# Altium schematic sheet Additional Circuits - Handheld - Rev 3b.SchDoc: Secure Handheld J1939 Logger
size Letter; Organization: Dr. Jeremy Daily; Address1: Systems Engineering; Address2: Engineering A202; Address3: Fort Collins, CO 80523; Address4: www.engr.colostate.edu/se/; DocumentNumber: Wifi, J1708, USB, and Security; Revision: 3c; SheetNumber: 2; SheetTotal: 3
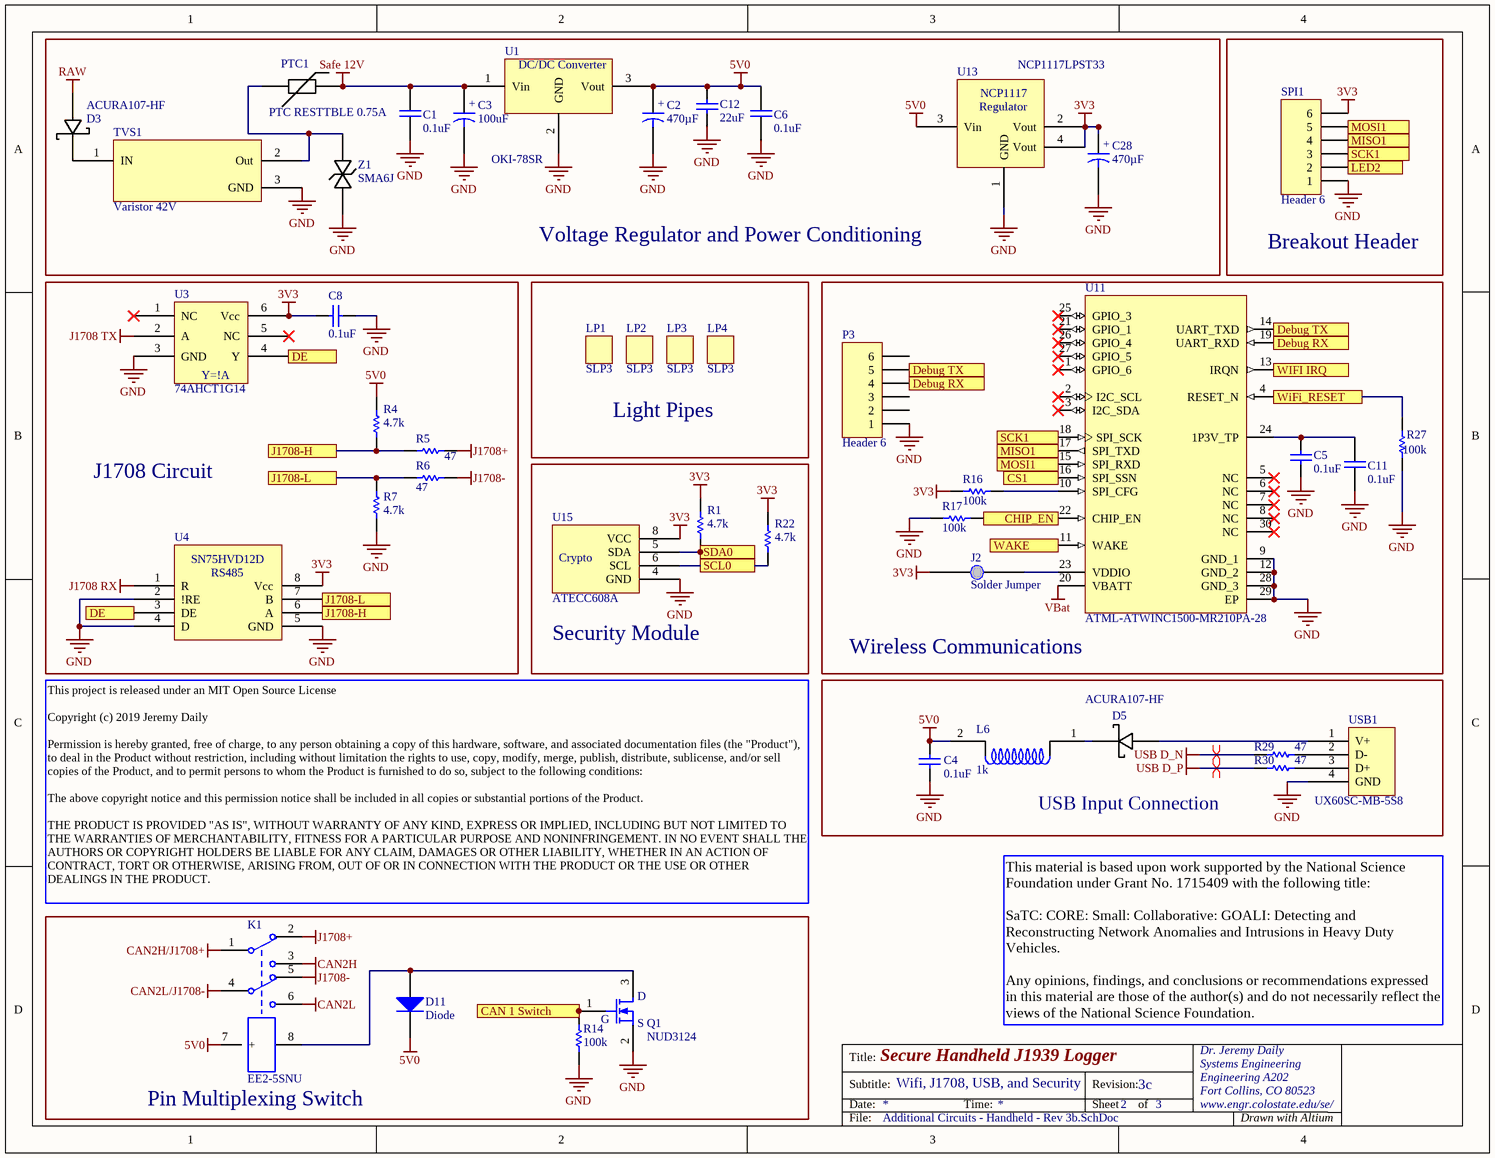
[diagram p0: Additional Circuits - Handheld - Rev 3b.SchDoc]

## Parts
C1  0.1uF  [0603]
C2  470µF  [Elec. Cap - G]
C3  100uF  [Elec. Cap - G]
C4  0.1uF  [0603]
C5  0.1uF  [0603]
C6  0.1uF  [0603]
C8  0.1uF  [0603]
C11  0.1uF  [0603]
C12  22uF  [1206]
C28  470µF  [Elec. Cap - G]
D3  ACURA107-HF  [SMA with A and K]
D5  ACURA107-HF  [SMA with A and K]
D11  Diode  [CST2C]
J2  Solder Jumper  [Solder Jumper]
K1  EE2-5SNU  [RELAY - EE2]
L6  1k  [0603]
LP1  SLP3  [PCBComponent_1]
LP2  SLP3  [PCBComponent_1]
LP3  SLP3  [PCBComponent_1]
LP4  SLP3  [PCBComponent_1]
P3  Header 6  [HDR1X6]
PTC1  PTC RESTTBLE 0.75A  [1812]
Q1  NUD3124  [SOT23_N]
R1  4.7k  [0603]
R4  4.7k  [0603]
R5  47  [0603]
R6  47  [0603]
R7  4.7k  [0603]
R14  100k  [0603]
R16  100k  [0603]
R17  100k  [0603]
R22  4.7k  [0603]
R27  100k  [0603]
R29  47  [0603]
R30  47  [0603]
SPI1  Header 6  [HDR1X6]
TVS1  Varistor 42V  [Transfeed]
U1  OKI-78SR  [OKI-78SR]
U3  74AHCT1G14  [SOT-353]
U4  SN75HVD08DR  [SOIC-SN8_N]  (value not drawn)
U11  ATML-ATWINC1500-MR210PA-28  [ATML-ATWINC1500-MR210PA-28_V]
U13  NCP1117LPST33  [SOT-223]
U15  ATECC608A  [SOIC-8]
USB1  UX60SC-MB-5S8  [USB Mini UX60S]
Z1  SMA6J  [SMA]

## Blocks framed on the sheet
Voltage Regulator and Power Conditioning: C1-C3 C6 C12 C28 D3 PTC1 TVS1 U1 U13 Z1
Breakout Header: SPI1
J1708 Circuit: C8 R4-R7 U3 U4
Light Pipes: LP1-LP4
Wireless Communications: C5 C11 J2 P3 R16 R17 R27 U11
Security Module: R1 R22 U15
USB Input Connection: C4 D5 L6 R29 R30 USB1
Pin Multiplexing Switch: D11 K1 Q1 R14

## Ports
CAN 1 Switch, CHIP_EN, CS1, DE, Debug RX, Debug TX, J1708-H, J1708-L, LED2, MISO1, MOSI1, SCK1, SCL0, SDA0, WAKE, WIFI IRQ, WiFi_RESET

## Nets
3V3: C8.2 C28.1 J2.1 R1.1 R16.2 R22.1 SPI1.6 U3.6(Vcc) U4.8(Vcc) U13.2(Vout) U13.4(Vout) U15.8(VCC)
5V0: C2.1 C4.1 C6.2 C12.2 D11.2(K) K1.7(+) L6.2 R4.1 U1.3(Vout) U13.3(Vin)
CAN2H: K1.3
CAN2H/J1708+: K1.1(COM1)
CAN2L: K1.6
CAN2L/J1708-: K1.4
GND: C1.1 C2.2(-) C3.2(-) C4.2 C5.1 C6.1 C8.1 C11.1 C12.1 C28.2(-) P3.1 Q1.2(Source) R7.2 R14.1 R17.2 R27.2 SPI1.1 TVS1.3(GND) U1.2(GND) U3.3(GND) U4.2(!RE) U4.4(D) U4.5(GND) U11.9(GND_1) U11.12(GND_2) U11.28(GND_3) U11.29(EP) U13.1(GND) U15.4(GND) USB1.4(GND) Z1.1(A)
J1708 RX: U4.1(R)
J1708 TX: U3.2(A)
J1708+: K1.2 R5.2
J1708-: K1.5 R6.2
RAW: D3.1(A)
Safe 12V: C1.2 C3.1 PTC1.2 U1.1(Vin)
USB D_N: R29.1
USB D_P: R30.1
VBat: U11.20(VBATT)
CAN 1 Switch: Q1.1(Gate) R14.2 ; port CAN 1 Switch
CHIP_EN: R17.1 U11.22(CHIP_EN) ; port CHIP_EN
CS1: U11.16(SPI_SSN) ; port CS1
DE: U3.4(Y) U4.3(DE) ; port DE
Debug RX: P3.4 U11.19(UART_RXD) ; port Debug RX
Debug TX: P3.5 U11.14(UART_TXD) ; port Debug TX
J1708-H: R4.2 R5.1 U4.6(A) ; port J1708-H
J1708-L: R6.1 R7.1 U4.7(B) ; port J1708-L
LED2: SPI1.2 ; port LED2
MISO1: SPI1.4 U11.17(SPI_TXD) ; port MISO1
MOSI1: SPI1.5 U11.15(SPI_RXD) ; port MOSI1
SCK1: SPI1.3 U11.18(SPI_SCK) ; port SCK1
SCL0: R22.2 U15.6(SCL) ; port SCL0
SDA0: R1.2 U15.5(SDA) ; port SDA0
WAKE: U11.11(WAKE) ; port WAKE
WIFI IRQ: U11.13(IRQN) ; port WIFI IRQ
WiFi_RESET: R27.1 U11.4(RESET_N) ; port WiFi_RESET
NetC5_2: C5.2 C11.2 U11.24(1P3V_TP)
NetD3_2: D3.2(K) TVS1.1(IN)
NetD5_1: D5.1(A) USB1.1(V+)
NetD5_2: D5.2(K) L6.1
NetD11_1: D11.1(A) K1.8(-) Q1.3(Drain)
NetJ2_2: J2.2 U11.23(VDDIO)
NetPTC1_1: PTC1.1 TVS1.2(Out) Z1.2(K)
NetR16_1: R16.1 U11.10(SPI_CFG)
NetR29_2: R29.2 USB1.2(D-)
NetR30_2: R30.2 USB1.3(D+)

Not connected (* = marked no-connect by the designer): P3 2 3 6; U3 1(NC)* 5(NC)*; U11 1(GPIO_6)* 2(I2C_SCL)* 3(I2C_SDA)* 5(NC)* 6(NC)* 7(NC)* 8(NC)* 21(GPIO_1)* 25(GPIO_3)* 26(GPIO_4)* 27(GPIO_5)* 30(NC)*

## Layout directives
differential pair: USB D_N, USB D_P

## Notes on the sheet
- This project is released under an MIT Open Source License
  Copyright (c) 2019 Jeremy Daily
  Permission is hereby granted, free of charge, to any person obtaining a copy of this hardware, software, and associated documentation files (the "Product"), to deal in the Product without restriction, including without limitation the rights to use, copy, modify, merge, publish, distribute, sublicense, and/or sell copies of the Product, and to permit persons to whom the Product is furnished to do so, subject to the following conditions:
  The above copyright notice and this permission notice shall be included in all copies or substantial portions of the Product.
  THE PRODUCT IS PROVIDED "AS IS", WITHOUT WARRANTY OF ANY KIND, EXPRESS OR IMPLIED, INCLUDING BUT NOT LIMITED TO THE WARRANTIES OF MERCHANTABILITY, FITNESS FOR A PARTICULAR PURPOSE AND NONINFRINGEMENT. IN NO EVENT SHALL THE AUTHORS OR COPYRIGHT HOLDERS BE LIABLE FOR ANY CLAIM, DAMAGES OR OTHER LIABILITY, WHETHER IN AN ACTION OF CONTRACT, TORT OR OTHERWISE, ARISING FROM, OUT OF OR IN CONNECTION WITH THE PRODUCT OR THE USE OR OTHER DEALINGS IN THE PRODUCT.
- This material is based upon work supported by the National Science Foundation under Grant No. 1715409 with the following title:
  SaTC: CORE: Small: Collaborative: GOALI: Detecting and Reconstructing Network Anomalies and Intrusions in Heavy Duty Vehicles.
  Any opinions, findings, and conclusions or recommendations expressed in this material are those of the author(s) and do not necessarily reflect the views of the National Science Foundation.
- Title:
- Subtitle:
- Date:
- Time:
- Revision:
- Sheet
- of
- File:
- Drawn with Altium
- (in symbol 74AHCT1G14 Inverter) Y=!A
- (in symbol 7805) DC/DC Converter
- (in symbol ATECC508A) Crypto
- (in symbol IRLML6344TRPbF) D; G; S
- (in symbol NCP1117 2.5V) NCP1117; Regulator
- (in symbol SN75HVD12D (3.3v RS485)) SN75HVD12D; RS485
- (in symbol Tantalum Cap_1) +

## Library data of the parts
C1 C4-C6 C8 C11 = Cap: CAP CER 0.1UF 50V X7R 0603; Manufacturer: KEMET; PartNumber: C0603C104K5RACAUTO; Alternative: Acceptable; Supplier 1: Digi-Key; Supplier Part Number 1: 399-6856-1-ND
C2 C28 = Tantalum Cap_1: 470µF 16V Aluminum Electrolytic Capacitors Radial, Can - SMD  5000 Hrs @ 105°C; Manufacturer: Panasonic Electronic Components; PartNumber: EEE-HC1C471P; Supplier 1: Digi-Key; Supplier Part Number 1: PCE3751CT-ND
C3 = Tantalum Cap_1: Aluminum Electrolytic Capacitors Radial, Can - SMD 5000 Hrs @ 105°C; Manufacturer: Panasonic Electronic Components; PartNumber: EEE-HC1H101P; Supplier 1: Digi-Key; Supplier Part Number 1: P19732CT-ND
C12 = Cap: 22µF ±20% 25V Ceramic Capacitor X5R 1206 (3216 Metric); Manufacturer: Murata Electronics North America; PartNumber: GRT31CR61E226ME01L; Supplier 1: Digi-Key; Supplier Part Number 1: 490-12451-1-ND
D3 D5 = Schottky Diode: Diode Schottky 1000V 1A Surface Mount DO-214AC (SMA); Manufacturer: Comchip Technology; Supplier 1: Digi-Key; Supplier Part Number 1: 641-1884-1-ND; PartNumber: ACURA107-HF
D11 = Diode: Default Diode; Manufacturer: Toshiba Semiconductor and Storage; PartNumber: CCS15S30L3FCT-ND; Supplier 1: Digi-Key; Supplier Part Number 1: CCS15S30L3FCT-ND
K1 = DPDT Relay: General Purpose Relay DPDT (2 Form C) Surface Mount; Manufacturer: KEMET; Supplier 1: Digi-Key; Supplier Part Number 1: 399-11057-5-ND; PartNumber: EE2-5SNU
L6 = Ferrite Bead: Ferrite Beads Multi-Layer Power 1KOhm 25% 100MHz 1A 200mOhm DCR 0603 Automotive T/R; Manufacturer: Murata; PartNumber: BLM18KG102SZ1D; Alternative: Acceptable; Supplier 1: Digi-Key; Supplier Part Number 1: 490-17350-1-ND
LP1-LP4 = SLP3: Light Pipe Single Clear Rigid Round with Domed Top, 3mm Board Mount, Press Fit, Right Angle; Manufacturer: Bivar Inc.; PartNumber: SLP3-150-250-R; Supplier 1: Digi-Key; Supplier Part Number 1: 492-2517-ND
P3 SPI1 = Header 6: Header, 6-Pin
PTC1 = PTC: PTC RESTTBLE 0.75A 33V CHIP 1812; Manufacturer: Bel Fuse Inc.; PartNumber: 0ZCG0075BF2B; Supplier 1: Digi-Key; Supplier Part Number 1: 507-1765-1-ND
Q1 = IRLML6344TRPbF: IC INDCT LOAD DRVR AUTO SOT23; Manufacturer: ON Semiconductor; PartNumber: NUD3124LT1G; Alternative: None; Supplier 1: Digi-Key; Supplier Part Number 1: NUD3124LT1GOSCT-ND
R1 R4 R7 R22 = Chip Resistor: 4.7 kOhms ±1% 0.1W, 1/10W Chip Resistor 0603 (1608 Metric) Automotive AEC-Q200, High Voltage Thick Film; Manufacturer: Rohm Semiconductor; PartNumber: KTR03EZPF4701; Alternative: Acceptable; Supplier 1: Digi-Key; Supplier Part Number 1: RHM4.7KAYCT-ND
R5 R6 R29 R30 = Chip Resistor: ±1% 0.1W, 1/10W Chip Resistor 0603 (1608 Metric) Automotive AEC-Q200, High Voltage Thick Film; Manufacturer: Rohm Semiconductor; PartNumber: KTR03EZPF47R0; Supplier 1: Digi-Key; Supplier Part Number 1: RHM47AYCT-ND
R14 R16 R17 R27 = Chip Resistor: 100 kOhms ±1% 0.1W, 1/10W Chip Resistor 0603 (1608 Metric) Automotive AEC-Q200, High Voltage Thick Film; Manufacturer: Rohm Semiconductor; PartNumber: KTR03EZPF1003; Alternative: Acceptable; Supplier 1: Digi-Key; Supplier Part Number 1: RHM100KAYCT-ND
TVS1 = Transfeed: VARISTOR CAP FEEDTHRU 18V 0805; Manufacturer: AVX; PartNumber: V2F118A400Y2EDP; Supplier 1: Digi-Key; Supplier Part Number 1: 478-2485-1-ND
U1 = 7805: 5V DC/DC Converter (7805 replacement); Manufacturer: Murata Power Solutions Inc.; PartNumber: OKI-78SR-5/1.5-W36H-C; Supplier 1: Digi-Key; Supplier Part Number 1: 811-2692-ND
U3 = 74AHCT1G14 Inverter: IC SCHMIT-TRIGG INV GATE SOT353; Manufacturer: Diodes Incorporated; PartNumber: 74AHCT1G14SE-7; Supplier 1: Digi-Key; Supplier Part Number 1: 74AHCT1G14SE-7DICT-ND
U4 = SN75HVD12D (3.3v RS485): IC RS485 TXRX 3/5V 8-SOIC; Manufacturer: Texas Instruments; PartNumber: SN75HVD08DR; Supplier 1: Digi-Key; Supplier Part Number 1: 296-37893-1-ND
U11 = ATML-ATWINC1500-MR210PA-28: SMARTCONNECT ATWINC1500B-MU-T MO; Manufacturer: Microchip Technologies; PartNumber: ATWINC1510-MR210PB1140; Supplier 1: Digi-Key; Supplier Part Number 1: ATWINC1510-MR210PB1140-ND
U13 = NCP1117 2.5V: Linear Voltage Regulator IC Positive Fixed Output 3.3V 1A SOT-223; Manufacturer: On Semiconductor; PartNumber: NCP1117LPST33T3G; Supplier 1: Digi-Key; Supplier Part Number 1: NCP1117LPST33T3GOSCT-ND
U15 = ATECC508A: Authentication Chip IC Networking and Communications 8-SOIC; Manufacturer: Microchip Technology; PartNumber: ATECC608A-SSHDA-T; Supplier Part Number 1: ATECC608A-SSHDA-TCT-ND; Supplier 1: Digi-Key
USB1 = USB-Rugged: USB - mini B USB 2.0 Receptacle Connector 5 Position Surface Mount, Right Angle; Through Hole; Manufacturer: Hirose; Supplier 1: Digi-Key; Supplier Part Number 1: H11589CT-ND; PartNumber: UX60SC-MB-5S8
Z1 = Zener - Bidirectional: TVS DIODE 20VWM 36.8VC SMA; Manufacturer: Micro Commercial Co; PartNumber: SMA6J24CA-TP; Supplier 1: Digi-Key; Supplier Part Number 1: SMA6J24CA-TPMSCT-ND